# EAGLE design Adafruit LIS3MDL (EAGLE 9.5.1)
COMPANY: ADAFRUIT INDUSTRIES; DRAWN: KTOWN; REV: A
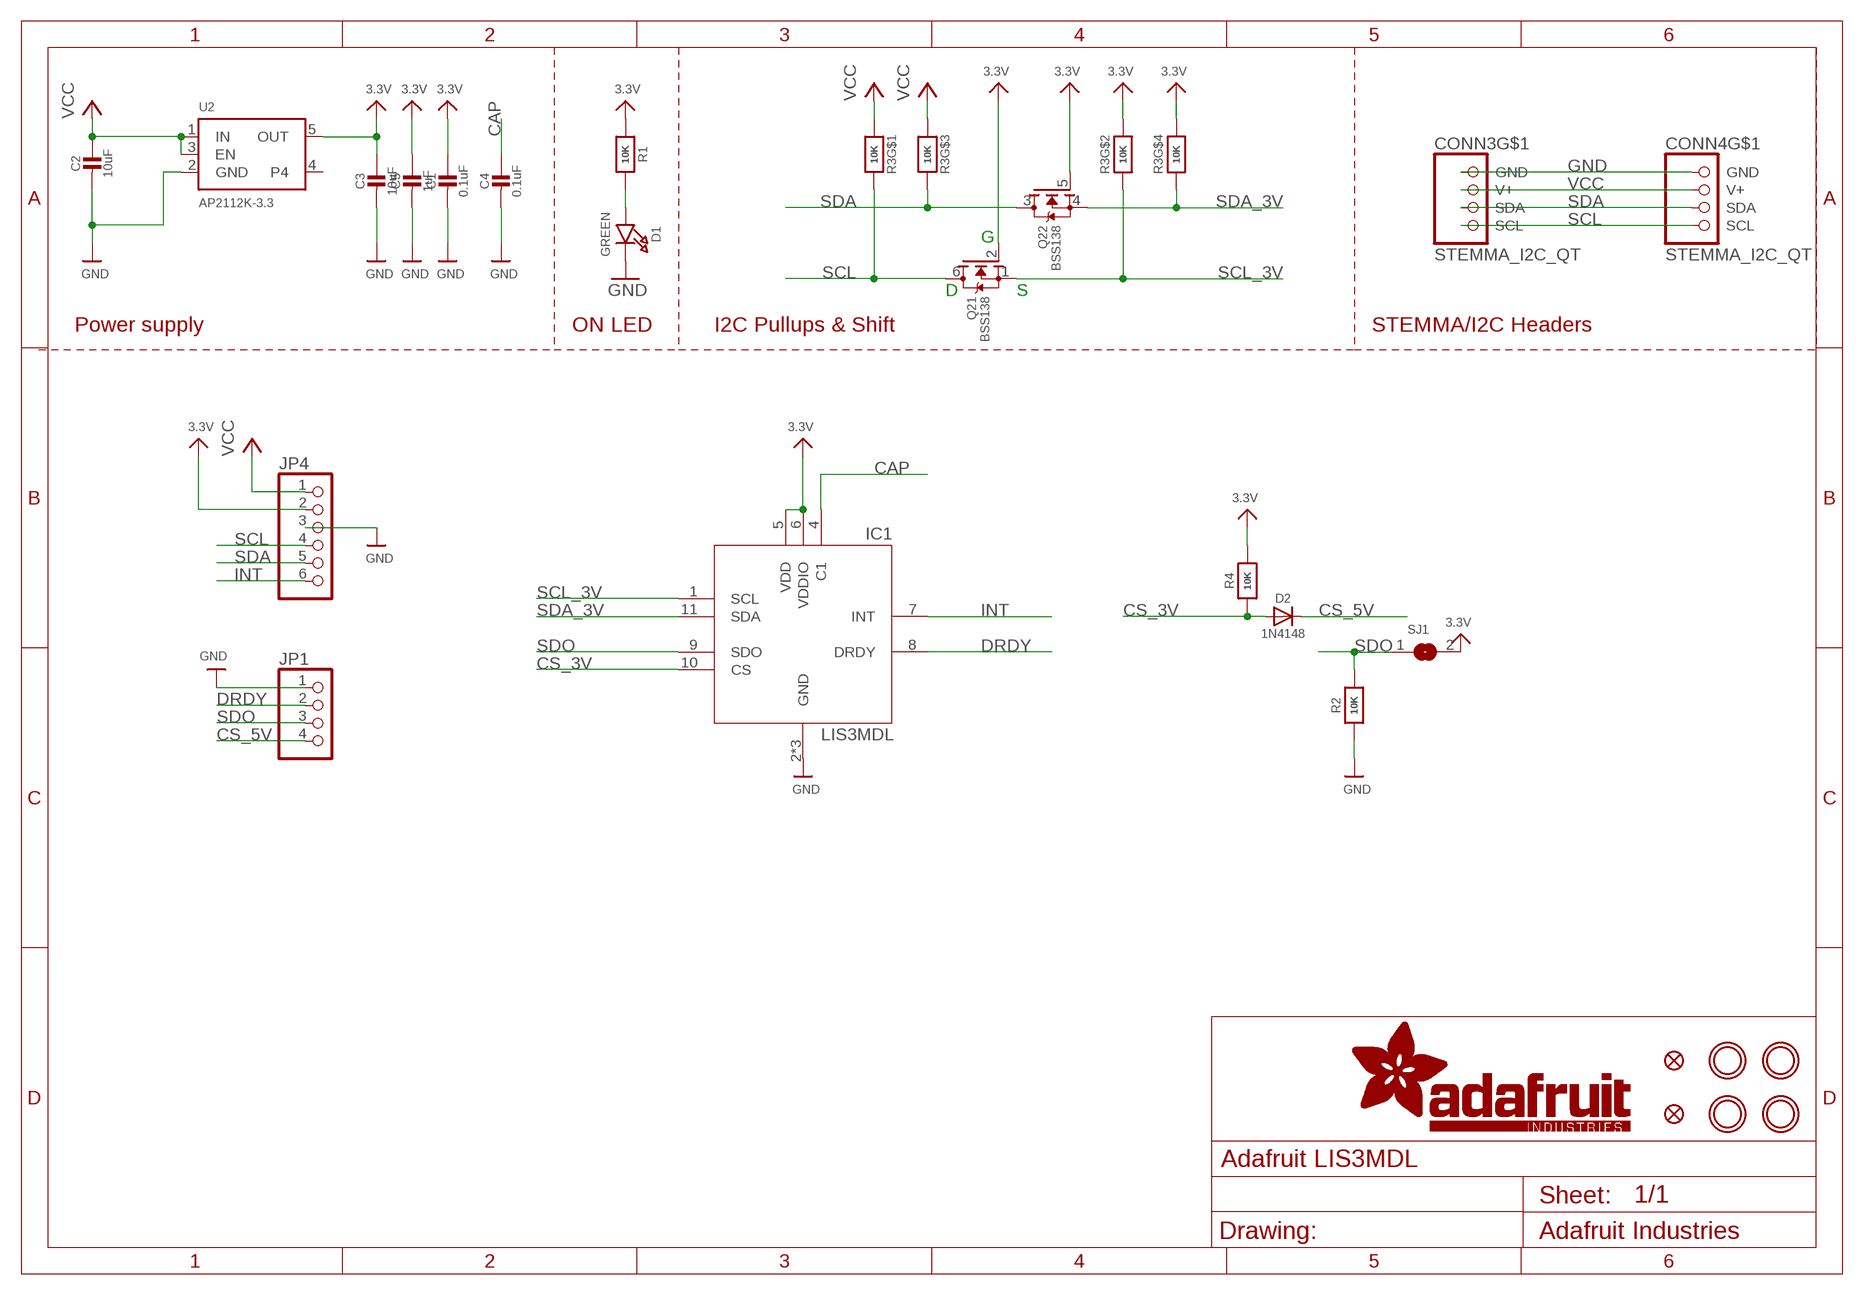
[diagram p0: schematic, sheet 1]

## Parts
C1  0.1uF  CAP_CERAMIC0603_NO  [0603-NO]
C2  10uF  CAP_CERAMIC0805-NOOUTLINE  [0805-NO]
C3  10uF  CAP_CERAMIC0805-NOOUTLINE  [0805-NO]
C4  0.1uF  CAP_CERAMIC0603_NO  [0603-NO]
C5  1uF  CAP_CERAMIC0603_NO  [0603-NO]
CONN3  STEMMA_I2C_QT  [JST_SH4]
CONN4  STEMMA_I2C_QT  [JST_SH4]
D1  GREEN  LED0603_NOOUTLINE  [CHIPLED_0603_NOOUTLINE]
D2  1N4148  DIODESOD-323  [SOD-323]
FID3  FIDUCIAL_1MM  [FIDUCIAL_1MM]
FID4  FIDUCIAL_1MM  [FIDUCIAL_1MM]
IC1  LIS3MDL  [LGA12_2X2MM]
JP1  HEADER-1X4ROUND  [1X04_ROUND]
JP4  HEADER-1X670MIL  [1X06_ROUND_70]
Q2  BSS138  MOSFET-N_DUAL  [SOT363]
R1  10K  RESISTOR_0603_NOOUT  [0603-NO]
R2  10K  RESISTOR_0603_NOOUT  [0603-NO]
R3  10K  RESISTOR_4PACK  [RESPACK_4X0603]
R4  10K  RESISTOR_0603_NOOUT  [0603-NO]
SJ1  SOLDERJUMPER  [SOLDERJUMPER_ARROW_NOPASTE]
U2  AP2112K-3.3  VREG_SOT23-5  [SOT23-5]
U$1  MOUNTINGHOLE2.5  [MOUNTINGHOLE_2.5_PLATED]
U$17  MOUNTINGHOLE2.5  [MOUNTINGHOLE_2.5_PLATED]
U$19  MOUNTINGHOLE2.5  [MOUNTINGHOLE_2.5_PLATED]
U$21  MOUNTINGHOLE2.5  [MOUNTINGHOLE_2.5_PLATED]

## Nets
3.3V [lowpower]: C1.1 C3.1 C5.1 IC1.5(VDD) IC1.6(VDDIO) JP4.2 Q2.2(1:G) Q2.5(2:G) R1.1 R3.2 R3.4 R4.2 SJ1.2 U2.5(OUT)
CAP [lowpower]: C4.1 IC1.4(C1)
CS_3V: D2.A IC1.10(CS) R4.1
CS_5V: D2.C JP1.4
DRDY: IC1.8(DRDY) JP1.2
GND: C1.2 C2.2 C3.2 C4.2 C5.2 CONN3.1(GND) CONN4.1(GND) D1.C IC1.2(GND) IC1.3(GND) IC1.12(GND) JP1.1 JP4.3 R2.1 U2.2(GND)
INT: IC1.7(INT) JP4.6
N$1: D1.A R1.2
SCL: CONN3.4(SCL) CONN4.4(SCL) JP4.4 Q2.6(1:D) R3.8
SCL_3V: IC1.1(SCL) Q2.1(1:S) R3.7
SDA: CONN3.3(SDA) CONN4.3(SDA) JP4.5 Q2.3(2:D) R3.6
SDA_3V: IC1.11(SDA) Q2.4(2:S) R3.5
SDO: IC1.9(SDO) JP1.3 R2.2 SJ1.1
VCC [highpower]: C2.1 CONN3.2(V+) CONN4.2(V+) JP4.1 R3.1 R3.3 U2.1(IN) U2.3(EN)
Unconnected: CONN3.MT1(MT) CONN3.MT2(MT) CONN4.MT1(MT) CONN4.MT2(MT) U2.4

## Notes on the sheet
- G
- D | S
- Power supply | ON LED | I2C Pullups & Shift | STEMMA/I2C Headers

## Library data of the parts
C1-C5 = microbuilder:CAP_CERAMIC: Ceramic Capacitors For new designs, use the packages preceded by an '_' character since they are more reliable: The following footprints should be used on most boards: _0402 - Standard footprint for regular board layouts _0603 - Standard footprint for regular board layouts _0805 - Standard footprint for regular board layouts _1206 - Standard footprint for regular board layouts For extremely tight-pitch boards where space is at a premium, the following 'micro-pitch' footprints can be used (smaller pads, no silkscreen outline, etc.): _0402MP - Micro-pitch footprint for very dense/compact boards _0603MP - Micro-pitch footprint for very dense/compact boards _0805MP - Micro-pitch footprint for very dense/compact boards _1206MP - Micro-pitch footprint for very dense/compact boards
CONN3 CONN4 = microbuilder:STEMMA_I2C
D1 = microbuilder:LED: LED 0603 - 0603 Surface Mount Package 2mA: Green LED - Low Power (3.9mcd, 2ma, 1.7Vf) - Digikey: 475-2709-2-ND Orange LED - Low Power (9.8mcd, 2ma, 1.8Vf) - Digikey: 475-1194-2-ND Red LED - Low Power (5mcd, 2ma, 1.8Vf) - Digikey: 475-1195-2-ND Yellow LED - Low Power (7mcd, 2ma, 1.8Vf) - Digikey: 475-1196-2-ND 5mA: Blue LED - Low Power (17mcd, 5ma, 2.9Vf) - Digikey: LNJ937W8CRACT-ND 0805 - 0805 Surface Mount Package 2mA: Red LED (8.8mcd, 2mA, 1.8Vf, Clear) - Low Power [Digikey: 475-2510-1-ND] Green LED (5mcd, 2mA, 1.8Vf, Clear) - Low Power [Digikey: 475-2730-1-ND] Yellow LED (11.3mcd, 2mA, 1.8Vf, Clear) - Low Power [Digikey: 475-2555-1-ND] 20mA: Red LED (104mcd, 20mA, Diffused) - LS R976 [Digikey: 475-1278-6-ND] Red LED (12mcd, 20mA, 2.0Vf, Clear) - APT2012EC [Digikey: 754-1128-1-ND] Green LED (15mcd, 20mA, 2.2Vf, Clear) - APT2012GC [Digikey: 754-1131-1-ND] Orange LED (160mcd, 20mA, 2.1Vf, Clear) - APT2012SECK [Digikey: 754-1130-1-ND] 1206 - 1206 Surface Mount Package Green LED (26mcd, 20mA, Diffused) - LG N971 [Digikey: 475-1407-6-ND] Red LED (15mcd, 20mA, Diffused) - LH N974 [Digikey: 475-1416-6-ND] Cree - Cree High-Power Surface Mount LEDs XPEBWT-L1-0000-00D50 - White 111lm 350mA 2.9Vf 6200K 110° XTEAWT-00-0000-00000LEE3 - White 114lm 350mA 2.85Vf 5000K 115° Everlight - Everlight 45-21 Series Surface Mount LEDs 45-21/QK2C-B2832AC2CB2/2T - Warm White 2000mcd 20mA 3.25Vf 3050K 120° 45-21/LK2C-B38452C4CB2/2T - Nuetral White 2000mcd 20mA 3.25Vf 4150K 120° 45-21/LK2C-B50634C6CB2/2T - Cold White 2200mcd 20mA 3.25Vf 5650K 120° PLCC2 Reverse Mount LS T77K-J1L2-1-0-2-R18-Z - Red 11.25mcd 2mA 1.8Vf 630nm 120° LO T77K-L1M2-24-Z - Orange 19.6mcd 2mA 1.8Vf 606nm 120° LY T77K-K2M1-26-Z - Yellow 15.7mcd 2mA 1.8Vf 587nm 120°
D2 = microbuilder:DIODE: Diode SMA Model Volts Amps Type Vf Ir Digikey # Notes SSA34-E3 40V 3A Schottky 480mV @ 3A 200uA @ 40V SSA34-E3/61TGITR-ND CDBA120-G 20V 1A Schottky 500mV @ 1A 500uA @ 20V 641-1014-6-ND REEL MBRA210 10V 2A Schottky 350mV @ 2A 700uA @ 10V MBRA210LT3 SOD-123 Model Volts Amps Type Vf Ir Order # Notes BAT54T1G 30V 200mA Schottky 800mV @ 200mA 2uA @ 25V BAT54T1GOSTR-ND B0530W 30V 500mA Schottky 430mV @ 500mA 130uA @ 30V B0530W-FDICT-ND REEL MBR120 20V 1A Schottky 340mV @ 1A MBR120VLSFT1GOSCT-ND SOD-323 Model Volts Amps Type Vf Ir Order # Notes PMEG2005EJ 20V 500mA Schottky 355mV @ 500mA 568-4110-1-ND ZLLS410 10V 570mA Schottky 380mV @ 570mA ZLLS410CT-ND 1N4148WS 75V 150mA Silicon/Simple 1V 1N4148WSFSCT-ND REEL SOD-523 Model Volts Amps Type Vf Ir Order # Notes BAT54XV2 30V 200mA Schottky 0.8V @ 100mA BAT54XV2CT-ND TB751S 30V 30mA Schottky RB751S-40TE61CT-ND SOT23-R/W (R = Solder Paste/Reflow Ovens, W = Hand-Soldering) Model Volts Amps Type Vf Ir Order # Notes BAT54FILM 40V 300mA Schottky 497-7162-1-ND POWERDI-5 Model Volts Amps Type Vf Ir Order # Notes PDS560 60V 5A Schottky 670mV @ 5A 150uA @ 60V PDS560DICT-ND
FID3 FID4 = microbuilder:FIDUCIAL: Fiducial Alignment Points Various fiducial points for machine vision alignment.; BOM: EXCLUDE
IC1 = adafruit_sensor:LIS3MDL: Digital output magnetic sensor. ultra-low-power, high-performance 3-axis magnetometer
JP1 = microbuilder:HEADER-1X4: PIN HEADER
JP4 = microbuilder:HEADER-1X6: PIN HEADER
Q2 = microbuilder:MOSFET-N_DUAL: Dual N-Channel MOSFET SOT363 (2.0x1.25mm) 2N7002PS - 60V, 320mA [Digikey: 568-5984-1-ND]
R1 R2 R4 = microbuilder:RESISTOR: Resistors For new designs, use the packages preceded by an '_' character since they are more reliable: The following footprints should be used on most boards: _0402 - Standard footprint for regular board layouts _0603 - Standard footprint for regular board layouts _0805 - Standard footprint for regular board layouts _1206 - Standard footprint for regular board layouts For extremely tight-pitch boards where space is at a premium, the following 'micro-pitch' footprints can be used (smaller pads, no silkscreen outline, etc.): _0402MP - Micro-pitch footprint for very dense/compact boards _0603MP - Micro-pitch footprint for very dense/compact boards _0805MP - Micro-pitch footprint for very dense/compact boards _1206MP - Micro-pitch footprint for very dense/compact boards
R3 = microbuilder:RESISTOR_4PACK: Resistor Packs (4 resistors) 4 x 0603 10K 1/16W - Digikey: YC164J-10KCT-ND
SJ1 = microbuilder:SOLDERJUMPER: SMD Solder JUMPER Solder the two pads together to create a connection, or remove the solder to break it. REFLOW - Use this footprint for solder paste and reflow ovens. WAVE - Use this footprint for hand-soldering (larger pads). CLOSED - Has a trace between the two pads to ensure it is closed by default. The trace needs to be cut to disable the jumper, and can be closed again by creating a solder bridge between the two pads.; BOM: EXCLUDE
U2 = microbuilder:VREG_SOT23-5: SOT23-5 Fixed Voltage Regulators Part Current Out V Out V In V Dropout θJA (°C/W) TJ (°C) Digikey Part No. ADP121 150mA 3.3V 3.4-5.5V 0.09V @ 150mA -- -- ADP121-AUJZ33R7CT-ND ADP121 150mA 3.0V 3.1-5.5V 0.09V @ 150mA -- -- ADP121-AUJZ30R7CT-ND ADP122 300mA 3.3V 3.4-5.5V 0.085V @ 300mA -- -- ADP122AUJZ-3.3-R7CT-ND ADP1712 300mA 3.3V 3.5-5.5V 0.17V @ 300mA -- -- ADP1712AUJZ-3.3-R7TR-ND AP7311 (Low Cost) 150mA 3.3V 3.5-6V 0.15V @ 150mA -- -- AP7311-33WG-7DICT-ND LD39015M18R 150mA 1.8V 1.9V-5.5V 0.08V @ 100mA -- -- 497-6977-1-ND LP2985A-33DBVR 150mA 3.3V 3.3-16V 0.28V @ 150mA 206 150 296-18479-1-ND MCP1824T-3302E/OT 300mA 3.3V 3.5V-6V 0.2V @ 300mA -- -- MCP1824T-3302E/OTCT-ND MIC5205-2.5YM5 TR 150mA 2.5V 2.7-16V 0.165V @ 150mA -- -- 576-1257-2-ND MIC5205-3.0YM5 TR 150mA 3.0V 3.2V-16V 0.165V @ 150mA -- -- 576-1258-2-ND MIC5205-3.3YM5 TR 150mA 3.3V 3.5V-16V 0.165V @ 150mA -- -- 576-1259-2-ND TPS780330220 150mA 3.3V+2.2V 3.6-5.5V 250mV Max -- -- 296-23332-1-ND TDA3663/N1,135 100mA 3.3V 3.5-45V 0.18V @ 50mA -- -- 568-5343-1-ND Max operating temp can be calculated using θJA, TJ (max junction temperature), and power in watts. Set the "Maximum Ambient Temperature" until it reaches TJ ("Max Junction Temperature"), which is the absolute limit for safe use of the regulator: Heat Sink Temperature Calculator <http://www.daycounter.com/Calculators/Heat-Sink-Temperature-Calculator.phtml> For example, With 12V source into a 3.3V LP2985 and a 30mA load, we are dissipating (12V-3.3V) * 0.03A = 0.261W. With a θJA of 206 °C/W, a TJ of 150°C, and 261mW we can safely use the chip without a heat sink up to 75°C (=147.1°C Junction Temperature).
U$1 U$17 U$19 U$21 = microbuilder:MOUNTINGHOLE: Mounting Hole For #2 screws (0.086"/2.18mm width, 0.094"/2.4mm hole) use 2.5mm; BOM: EXCLUDE

## Net classes
1 highpower: width 0.406 mm, drill 0.483 mm
2 lowpower: width 0.305 mm, drill 0.483 mm

## Board
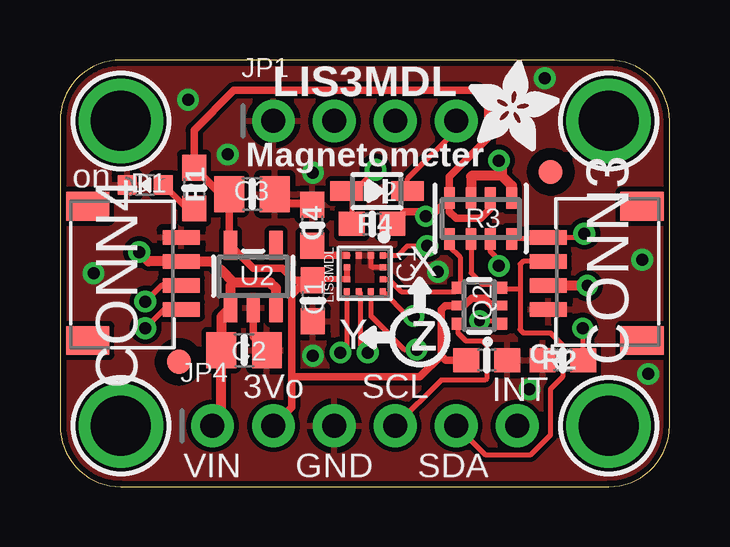
[diagram p1: board, top side]
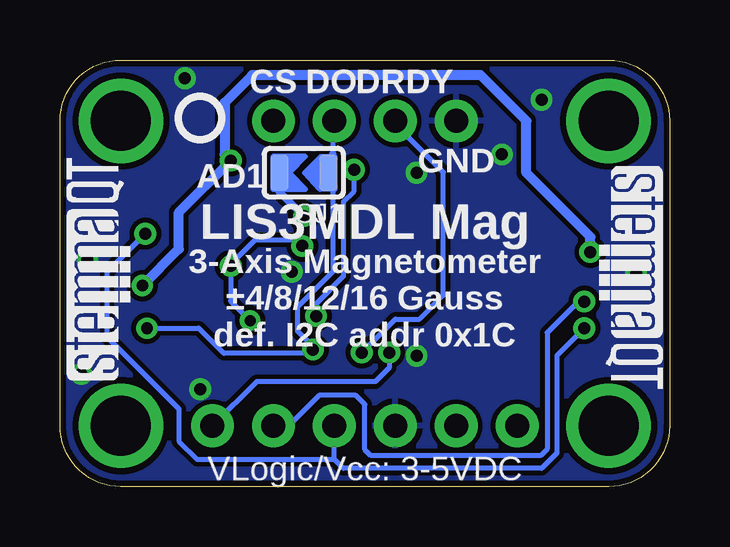
[diagram p2: board, bottom side, seen from below]

Size 25.4 x 17.78 mm. Coordinates in mm from the lower left corner, seen from the top.
Outline: 0,15.24 0,2.54 arc90 2.54,0 22.86,0 arc90 25.4,2.54 25.4,15.24 arc90 22.86,17.78 2.54,17.78 arc90 0,15.24
Copper layers (1*16): Top 0.035mm / dielectric 1.5mm / Bottom 0.035mm
Design rules "adafruit *": minimum track width 8mil, minimum drill 15.5mil, track to track 8mil, track to pad 8mil, pad to pad 8mil, via to via 8mil, smd to smd 8mil, copper to edge 10mil, drill to drill 8mil, minimum pad ring 10mil, minimum via ring 8mil, stop-mask expansion 2mil, vias tented up to drill 20mil, thermal gap 10mil

### Footprints (pad centres in the part's own frame; a part is rotated, then mirrored left to right if it is on the bottom)
0603-NO = smd 1.075 x 1: 1 -0.85,0; 2 0.85,0
0805-NO = smd 1.24 x 1.5: 1 -0.95,0; 2 0.95,0
JST_SH4 = smd 0.6 x 1.55: 1 -1.5,2.514; 2 -0.5,2.514; 3 0.5,2.514; 4 1.5,2.514 | smd 1.2 x 1.8: MT1 -2.8,-1.386; MT2 2.8,-1.386
CHIPLED_0603_NOOUTLINE = smd 0.8 x 0.8: A 0,-0.75; C 0,0.75
SOD-323 = smd 1.35 x 0.8: A 1.27,0; C -1.27,0
FIDUCIAL_1MM = smd 1 x 1: 1 0,0
LGA12_2X2MM = smd 0.275 x 0.25: 1 -0.75,0.75; 2 -0.75,0.25; 3 -0.75,-0.25; 4 -0.75,-0.75; 7 0.75,-0.75; 8 0.75,-0.25; 9 0.75,0.25; 10 0.75,0.75 | smd 0.25 x 0.275: 5 -0.25,-0.75; 6 0.25,-0.75; 11 0.25,0.75; 12 -0.25,0.75
1X04_ROUND = drill 1 pad 1.778: 1 -3.81,0; 2 -1.27,0; 3 1.27,0; 4 3.81,0
1X06_ROUND_70 = drill 1 pad 1.778: 1 -6.35,0; 2 -3.81,0; 3 -1.27,0; 4 1.27,0; 5 3.81,0; 6 6.35,0
SOT363 = smd 0.5 x 0.5: 1 -0.75,-0.9; 3 0.75,-0.9; 4 0.75,0.9; 6 -0.75,0.9 | smd 0.4 x 0.5: 2 0,-0.9; 5 0,0.9
RESPACK_4X0603 = smd 0.45 x 0.9: 1 -1.3,-0.85; 2 -0.4,-0.85; 3 0.4,-0.85; 4 1.3,-0.85; 5 1.3,0.85; 6 0.4,0.85; 7 -0.4,0.85; 8 -1.3,0.85
SOLDERJUMPER_ARROW_NOPASTE = smd 0.762 x 1.524: 1 -1.016,0; 2 1.016,0
SOT23-5 = smd 0.55 x 1.2: 1 -0.95,-1.3; 2 0,-1.3; 3 0.95,-1.3; 4 0.95,1.3; 5 -0.95,1.3
MOUNTINGHOLE_2.5_PLATED = drill 2.5 pad 3.2: P$1 0,0

### Placement (x,y rotation side)
C1  10.54,7.75 270 top
C2  7.67,5.69 0 top
C3  8,12.19 0 top
C4  10.52,10.9 90 top
C5  17.78,5.27 0 top
CONN3  22.86,8.89 90 top
CONN4  2.54,8.89 270 top
D1  3.56,12.57 90 top
D2  13.21,12.32 180 top
FID3  4.95,5.21 0 top
FID4  20.45,13.12 0 top
IC1  12.7,8.89 270 top
JP1  12.7,15.24 0 top
JP4  12.7,2.54 0 top
Q2  17.48,7.54 90 top
R1  5.59,12.45 270 top
R2  20.95,5.27 0 top
R3  17.53,11.18 180 top
R4  13,10.95 0 top
SJ1  15.24,13.08 180 bottom
U2  8.05,8.76 0 top
U$1  2.54,15.24 0 top
U$11  [ADAFRUIT_3.5MM]  17.02,13.97 0 top
U$17  22.86,15.24 0 top
U$19  2.54,2.54 0 top
U$21  22.86,2.54 0 top
U$25  [PCBFEAT-REV-040]  19.56,15.37 0 bottom
U$30  [STEMMAQT]  22.48,4.45 90 bottom
U$31  [STEMMAQT]  2.92,13.34 270 bottom

### Tracks (layer width: path | path; a pad name or v marks a point on that pad's centre or on a via)
3.3V  (via drill 0.48)
  Top 0.254: 10.58,8.64 IC1.6 IC1.5
  Top 0.305: Q2.2 17.99,7.54 17.68,7.86 17.15,7.86 16.83,7.54 Q2.5 16.05,7.54 15.88,7.37 15.88,5.46 | 10.58,8.64 C1.1 | C1.1 9.78,8.6 9.27,9.11 8.06,9.11 U2.5 7.05,10.11 C3.1 6.69,12.19 R1.1 5.59,14.86 7.24,16.51 17.4,16.51 17.83,16.08 17.83,14.53 16.23,12.92 R3.4 | 15.49,11.46 15.65,11.46 R3.4 | 15.49,11.46 14.36,11.46 R4.2 | R3.2 17.93,11.58 17.53,11.18 16.51,11.18 16.23,11.46 R3.4 | C1.1 10.25,8.6 9.65,8 9.65,4.57 | JP4.2 9.65,3.3 9.65,4.57 | 9.65,4.57 14.99,4.57 15.88,5.46 | 15.49,11.46 15.31,11.27 v15.24,11.27 | 15.88,5.46 16.07,5.27 C5.1
  Bottom 0.305: SJ1.2 16.26,12.29 v15.24,11.27
CAP
  Top 0.305: IC1.4 10.92,9.64 C4.1
CS_3V  (via drill 0.5)
  Top 0.203: R4.1 12.15,12.1 D2.A 12.26,12.32 v13.15,13.21 | IC1.10 14.48,7.11 v14.73,7.11
  Bottom 0.203: v13.15,13.21 13.15,12.32 13.59,11.87 13.59,8.76 14.73,7.62 v14.73,7.11
CS_5V
  Top 0.203: D2.C 14.48,12.83 16.51,14.86 JP1.4
DRDY  (via drill 0.5)
  Top 0.203: IC1.8 12.52,8.07 12.52,5.89 v12.83,5.59
  Bottom 0.203: v12.83,5.59 11.43,6.99 10.41,6.99 9.42,7.98 9.42,13.11 11.43,15.11 JP1.2
GND  (via drill 0.5)
  Top 0.203: IC1.2 12.95,9.2 13.01,9.14 IC1.12
  Top 0.305: U2.2 8.05,6.26 C2.2 | C3.2 9.33,11.81 10.45,11.81 C4.2
  other vias: 1.4,8.89 10.54,13.08 10.54,5.46 15.75,8.95 24.51,4.7 20.19,17.02 6.99,13.84 5.33,16.13 24.26,9.46 19.56,4.06
  pour Top: 0,17.78 25.4,17.78 25.4,0 0,0
  pour Bottom: 0,17.78 25.4,17.78 25.4,0 0,0
INT  (via drill 0.5)
  Top 0.203: IC1.7 11.95,5.85 v11.68,5.59
  Bottom 0.203: v11.68,5.59 11.68,4.95 12.26,4.38 17.21,4.38 JP4.6
N$1
  Top 0.254: D1.A 5.28,11.6 R1.2
SCL  (via drill 0.5)
  Top 0.203: R3.8 20.28,10.33 CONN3.4 21.69,10.39 v21.84,10.54 | CONN4.4 4.34,7.39 v3.56,6.6 | Q2.6 16.57,6.41 16.91,6.08 17.59,6.08 17.77,5.9 17.77,4.5 17.72,4.45 15.88,4.45 JP4.4
  Bottom 0.203: 13.97,1.14 19.68,1.14 20.45,1.91 20.45,3.24 23.43,6.22 23.43,8.95 v21.84,10.54 | 13.97,1.14 JP4.4 | v3.56,6.6 4.7,5.46 4.7,1.4 5.33,0.76 13.59,0.76 13.97,1.14
SCL_3V  (via drill 0.45, 0.5)
  Top 0.203: R3.7 17.93,9.82 18.29,9.46 v18.29,9.2 | IC1.1 14.09,9.64 14.48,10.03 v15.3,10.03 | v17.48,6.92 18.25,6.92 Q2.1
  Bottom 0.203: v15.3,10.03 15.56,10.29 17.26,10.29 18.29,9.26 v18.29,9.2 18.29,7.73 v17.48,6.92
SDA  (via drill 0.5)
  Top 0.203: R3.6 17.13,8.91 17.61,8.42 18.25,8.42 Q2.3 18.41,8.26 19.18,8.26 | CONN3.3 19.3,9.39 19.18,9.27 19.18,8.26 | CONN4.3 4.23,8.39 v3.56,7.71 | JP4.5 17.72,1.33 19.62,1.33 20.45,2.16 20.45,4.08 20.95,4.58 20.95,5.9 20.43,6.41 19.3,6.41 19.18,6.54 19.18,8.26
  Bottom 0.203: v3.56,7.71 3.81,7.71 5.11,6.42 5.11,1.56 5.38,1.29 12.45,1.29 12.7,1.55 12.7,3.43 13.08,3.81 14.61,3.81 15.88,2.54 JP4.5
SDA_3V
  Top 0.203: R3.5 16.23,10.01 16.67,9.56 16.67,8.39 Q2.4 16.48,8.39 16.48,8.13 14.22,8.13 13.7,8.64 IC1.11
SDO  (via drill 0.48, 0.5)
  Top 0.203: IC1.9 12.95,7.12 14.35,5.71 v14.86,5.71 | v21.78,6.6 21.78,5.29 R2.2
  Bottom 0.203: 14.89,5.87 14.86,5.84 v14.86,5.71 | 14.89,5.87 15.49,6.48 15.49,7.49 14.03,8.95 14.03,13.08 | JP1.3 14.03,15.18 14.03,13.84 14.03,13.08 | 14.89,5.87 15.14,5.87 14.83,5.56 18.57,5.56 19.62,6.6 v21.78,6.6 | SJ1.1 14.03,13.08
  Bottom 0.305: SJ1.1 14.03,13.27 14.03,13.84
VCC  (via drill 0.48, 0.5)
  Top 0.406: U2.3 9,8.27 8.76,8.51 7.24,8.51 | 7.24,8.51 7.1,8.37 U2.1 6.72,7.08 C2.1 6.72,2.91 JP4.1 | 7.24,8.51 6.69,9.06 6.66,9.06 6.33,9.39 CONN4.2 3.69,9.39 v3.3,9.78 | R3.1 18.83,12.54 18.41,12.95 | 18.41,12.95 17.14,12.95 17.13,12.94 R3.3 | v18.29,13.59 18.41,13.46 18.41,12.95 | CONN3.2 v21.96,8.39 v21.97,8.38
  Bottom 0.406: v3.3,9.78 3.3,10.41 5.97,13.08 5.97,15.24 7.87,17.14 17.4,17.14 18.54,16 18.54,13.84 v18.29,13.59 20.45,11.43 20.45,9.91 v21.97,8.38

### Text on the board
tPlace: LIS3MDL | Magnetometer | on | X | Y | Z | 3Vo | SCL | INT | VIN | GND | SDA
bPlace: DRDY | DO | CS | GND | AD1 | LIS3MDL Mag | 3-Axis Magnetometer / ±4/8/12/16 Gauss / def. I2C addr 0x1C | VLogic/Vcc: 3-5VDC